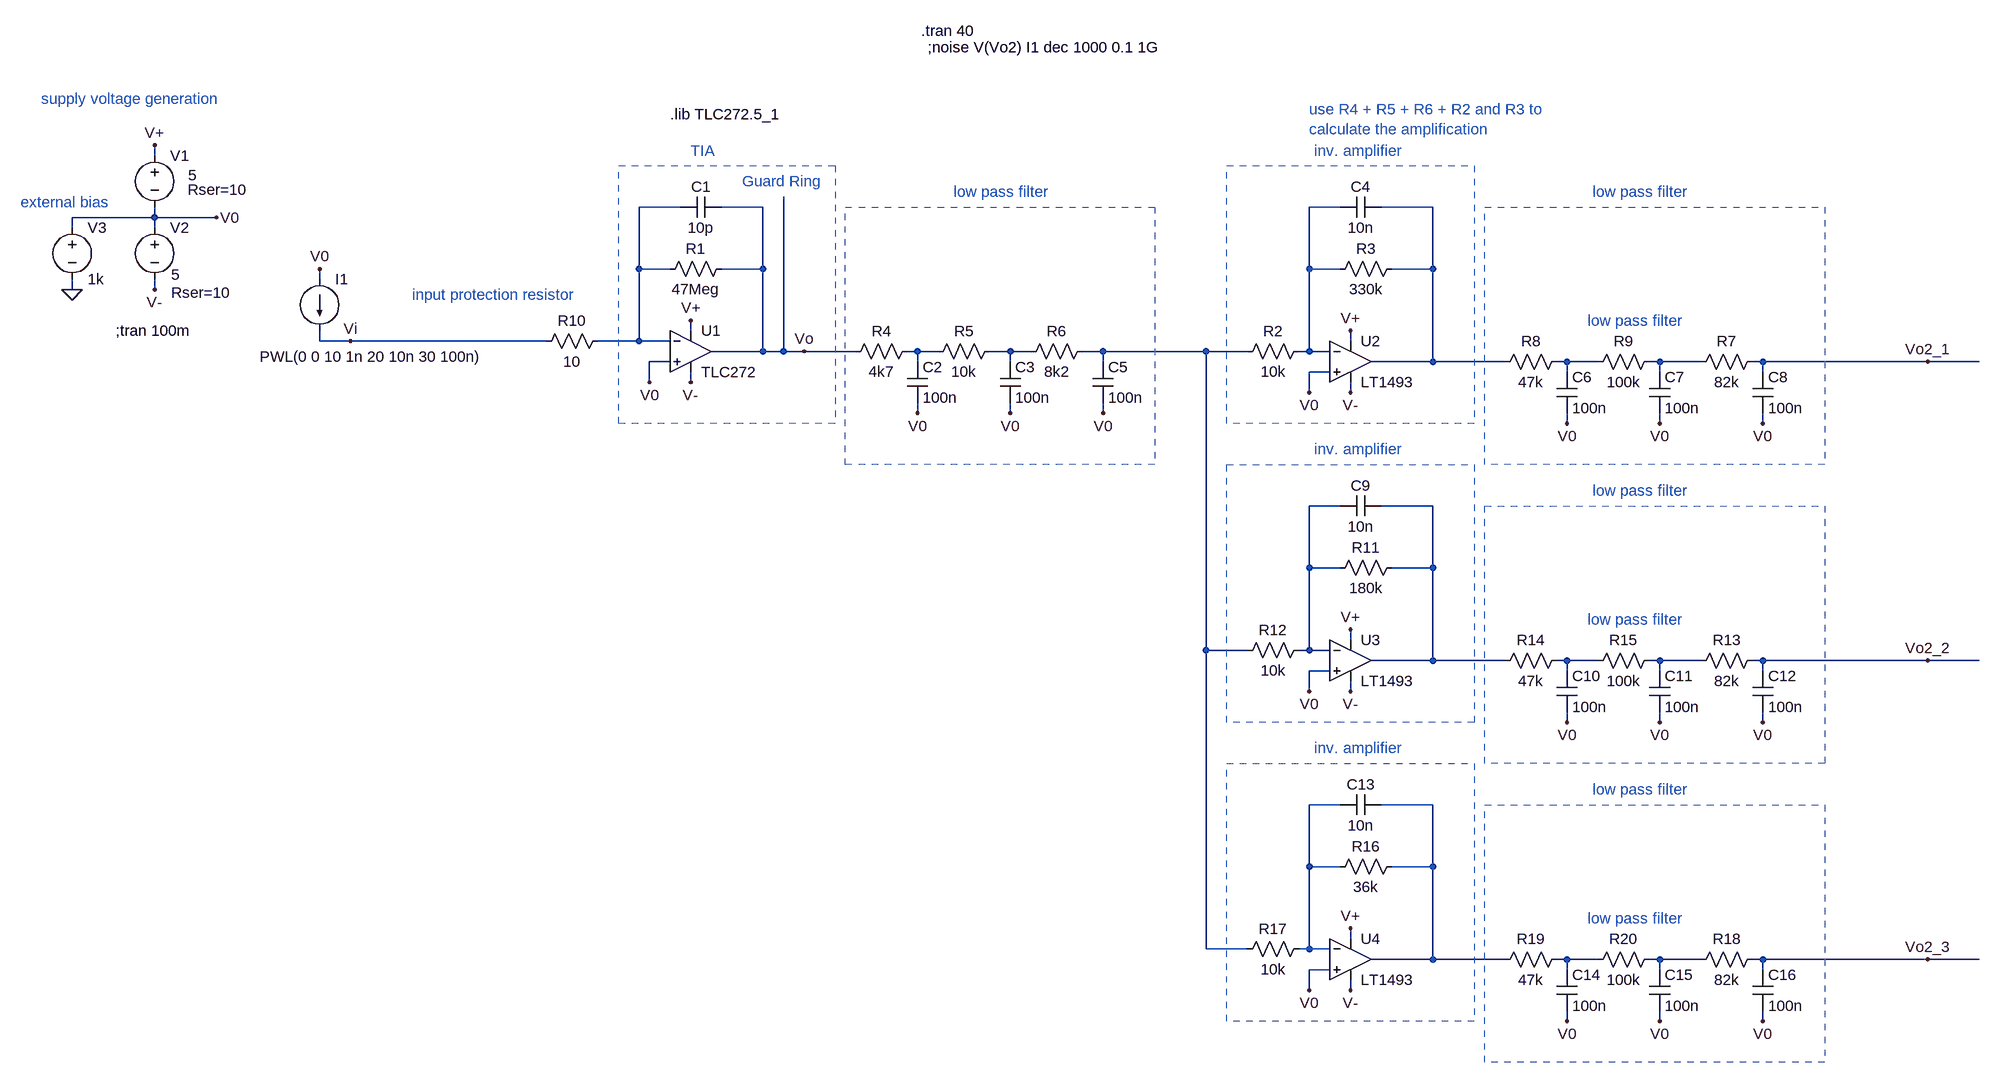
[diagram p0: schematic CurrentSensor.asc]
CurrentSensor.asc, the LTspice schematic file:
Version 4
SHEET 1 2468 1308
WIRE -736 -112 -736 -128
WIRE 80 -32 16 -32
WIRE 208 -32 144 -32
WIRE 1104 -32 1056 -32
WIRE 1248 -32 1168 -32
WIRE -736 -16 -736 -32
WIRE -736 -16 -864 -16
WIRE -640 -16 -736 -16
WIRE -864 0 -864 -16
WIRE -736 0 -736 -16
WIRE 16 64 16 -32
WIRE 64 64 16 64
WIRE 208 64 208 -32
WIRE 208 64 144 64
WIRE 1056 64 1056 -32
WIRE 1104 64 1056 64
WIRE 1248 64 1248 -32
WIRE 1248 64 1184 64
WIRE -480 80 -480 64
WIRE -864 96 -864 80
WIRE -736 96 -736 80
WIRE 96 160 96 144
WIRE -480 176 -480 160
WIRE -432 176 -480 176
WIRE -128 176 -432 176
WIRE 16 176 16 64
WIRE 16 176 -48 176
WIRE 64 176 16 176
WIRE 1120 176 1120 160
WIRE 208 192 208 64
WIRE 208 192 128 192
WIRE 240 192 240 -48
WIRE 240 192 208 192
WIRE 272 192 240 192
WIRE 352 192 272 192
WIRE 448 192 432 192
WIRE 480 192 448 192
WIRE 592 192 560 192
WIRE 624 192 592 192
WIRE 736 192 704 192
WIRE 896 192 736 192
WIRE 960 192 896 192
WIRE 1056 192 1056 64
WIRE 1056 192 1040 192
WIRE 1088 192 1056 192
WIRE 64 208 32 208
WIRE 448 208 448 192
WIRE 592 208 592 192
WIRE 736 208 736 192
WIRE 1248 208 1248 64
WIRE 1248 208 1152 208
WIRE 1360 208 1248 208
WIRE 1456 208 1440 208
WIRE 1504 208 1456 208
WIRE 1600 208 1584 208
WIRE 1664 208 1600 208
WIRE 1760 208 1744 208
WIRE 2016 208 1760 208
WIRE 2096 208 2016 208
WIRE 1088 224 1056 224
WIRE 1456 224 1456 208
WIRE 1600 224 1600 208
WIRE 1760 224 1760 208
WIRE 32 240 32 208
WIRE 96 240 96 224
WIRE 1056 256 1056 224
WIRE 1120 256 1120 240
WIRE 448 288 448 272
WIRE 592 288 592 272
WIRE 736 288 736 272
WIRE 1456 304 1456 288
WIRE 1600 304 1600 288
WIRE 1760 304 1760 288
WIRE 1104 432 1056 432
WIRE 1248 432 1168 432
WIRE 1056 528 1056 432
WIRE 1104 528 1056 528
WIRE 1248 528 1248 432
WIRE 1248 528 1184 528
WIRE 1120 640 1120 624
WIRE 896 656 896 192
WIRE 960 656 896 656
WIRE 1056 656 1056 528
WIRE 1056 656 1040 656
WIRE 1088 656 1056 656
WIRE 1248 672 1248 528
WIRE 1248 672 1152 672
WIRE 1360 672 1248 672
WIRE 1456 672 1440 672
WIRE 1504 672 1456 672
WIRE 1600 672 1584 672
WIRE 1664 672 1600 672
WIRE 1760 672 1744 672
WIRE 2016 672 1760 672
WIRE 2096 672 2016 672
WIRE 1088 688 1056 688
WIRE 1456 688 1456 672
WIRE 1600 688 1600 672
WIRE 1760 688 1760 672
WIRE 1056 720 1056 688
WIRE 1120 720 1120 704
WIRE 1456 768 1456 752
WIRE 1600 768 1600 752
WIRE 1760 768 1760 752
WIRE 1104 896 1056 896
WIRE 1248 896 1168 896
WIRE 1056 992 1056 896
WIRE 1104 992 1056 992
WIRE 1248 992 1248 896
WIRE 1248 992 1184 992
WIRE 1120 1104 1120 1088
WIRE 896 1120 896 656
WIRE 960 1120 896 1120
WIRE 1056 1120 1056 992
WIRE 1056 1120 1040 1120
WIRE 1088 1120 1056 1120
WIRE 1248 1136 1248 992
WIRE 1248 1136 1152 1136
WIRE 1360 1136 1248 1136
WIRE 1456 1136 1440 1136
WIRE 1504 1136 1456 1136
WIRE 1600 1136 1584 1136
WIRE 1664 1136 1600 1136
WIRE 1760 1136 1744 1136
WIRE 2016 1136 1760 1136
WIRE 2096 1136 2016 1136
WIRE 1088 1152 1056 1152
WIRE 1456 1152 1456 1136
WIRE 1600 1152 1600 1136
WIRE 1760 1152 1760 1136
WIRE 1056 1184 1056 1152
WIRE 1120 1184 1120 1168
WIRE 1456 1232 1456 1216
WIRE 1600 1232 1600 1216
WIRE 1760 1232 1760 1216
FLAG -736 -128 V+
FLAG -736 96 V-
FLAG 96 144 V+
FLAG 96 240 V-
FLAG 272 192 Vo
FLAG -480 64 V0
FLAG 32 240 V0
FLAG -640 -16 V0
FLAG -864 96 0
FLAG -432 176 Vi
FLAG 1120 160 V+
FLAG 1120 256 V-
FLAG 1056 256 V0
FLAG 2016 208 Vo2_1
FLAG 448 288 V0
FLAG 592 288 V0
FLAG 736 288 V0
FLAG 1456 304 V0
FLAG 1600 304 V0
FLAG 1760 304 V0
FLAG 1120 624 V+
FLAG 1120 720 V-
FLAG 1056 720 V0
FLAG 2016 672 Vo2_2
FLAG 1456 768 V0
FLAG 1600 768 V0
FLAG 1760 768 V0
FLAG 1120 1088 V+
FLAG 1120 1184 V-
FLAG 1056 1184 V0
FLAG 2016 1136 Vo2_3
FLAG 1456 1232 V0
FLAG 1600 1232 V0
FLAG 1760 1232 V0
SYMBOL Opamps\\opamp2 96 128 R0
SYMATTR InstName U1
SYMATTR Value TLC272
SYMBOL voltage -736 -128 R0
WINDOW 3 52 46 Left 2
WINDOW 123 0 0 Left 0
WINDOW 39 51 69 Left 2
SYMATTR InstName V1
SYMATTR Value 5
SYMATTR SpiceLine Rser=10
SYMBOL voltage -736 -16 R0
WINDOW 3 26 89 Left 2
WINDOW 123 0 0 Left 0
WINDOW 39 26 117 Left 2
SYMATTR InstName V2
SYMATTR Value 5
SYMATTR SpiceLine Rser=10
SYMBOL res 160 48 R90
WINDOW 0 0 56 VBottom 2
WINDOW 3 32 56 VTop 2
SYMATTR InstName R1
SYMATTR Value 47Meg
SYMBOL current -480 80 R0
WINDOW 3 -93 120 Left 2
WINDOW 123 0 0 Left 0
WINDOW 39 0 0 Left 0
SYMATTR InstName I1
SYMATTR Value PWL(0 0 10 1n 20 10n 30 100n)
SYMBOL voltage -864 -16 R0
WINDOW 123 0 0 Left 0
WINDOW 39 0 0 Left 0
SYMATTR InstName V3
SYMATTR Value 1k
SYMBOL res 720 176 R90
WINDOW 0 0 56 VBottom 2
WINDOW 3 32 56 VTop 2
SYMATTR InstName R6
SYMATTR Value 8k2
SYMBOL res 1200 48 R90
WINDOW 0 0 56 VBottom 2
WINDOW 3 32 56 VTop 2
SYMATTR InstName R3
SYMATTR Value 330k
SYMBOL cap 144 -48 R90
WINDOW 0 0 32 VBottom 2
WINDOW 3 32 32 VTop 2
SYMATTR InstName C1
SYMATTR Value 10p
SYMBOL res 448 176 R90
WINDOW 0 0 56 VBottom 2
WINDOW 3 32 56 VTop 2
SYMATTR InstName R4
SYMATTR Value 4k7
SYMBOL cap 432 208 R0
SYMATTR InstName C2
SYMATTR Value 100n
SYMBOL res 576 176 R90
WINDOW 0 0 56 VBottom 2
WINDOW 3 32 56 VTop 2
SYMATTR InstName R5
SYMATTR Value 10k
SYMBOL cap 576 208 R0
SYMATTR InstName C3
SYMATTR Value 100n
SYMBOL cap 1168 -48 R90
WINDOW 0 0 32 VBottom 2
WINDOW 3 32 32 VTop 2
SYMATTR InstName C4
SYMATTR Value 10n
SYMBOL cap 720 208 R0
SYMATTR InstName C5
SYMATTR Value 100n
SYMBOL res 1056 176 R90
WINDOW 0 0 56 VBottom 2
WINDOW 3 32 56 VTop 2
SYMATTR InstName R2
SYMATTR Value 10k
SYMBOL res 1760 192 R90
WINDOW 0 0 56 VBottom 2
WINDOW 3 32 56 VTop 2
SYMATTR InstName R7
SYMATTR Value 82k
SYMBOL res 1456 192 R90
WINDOW 0 0 56 VBottom 2
WINDOW 3 32 56 VTop 2
SYMATTR InstName R8
SYMATTR Value 47k
SYMBOL cap 1440 224 R0
SYMATTR InstName C6
SYMATTR Value 100n
SYMBOL res 1600 192 R90
WINDOW 0 0 56 VBottom 2
WINDOW 3 32 56 VTop 2
SYMATTR InstName R9
SYMATTR Value 100k
SYMBOL cap 1584 224 R0
SYMATTR InstName C7
SYMATTR Value 100n
SYMBOL cap 1744 224 R0
SYMATTR InstName C8
SYMATTR Value 100n
SYMBOL res -32 160 R90
WINDOW 0 0 56 VBottom 2
WINDOW 3 32 56 VTop 2
SYMATTR InstName R10
SYMATTR Value 10
SYMBOL res 1200 512 R90
WINDOW 0 0 56 VBottom 2
WINDOW 3 32 56 VTop 2
SYMATTR InstName R11
SYMATTR Value 180k
SYMBOL cap 1168 416 R90
WINDOW 0 0 32 VBottom 2
WINDOW 3 32 32 VTop 2
SYMATTR InstName C9
SYMATTR Value 10n
SYMBOL res 1056 640 R90
WINDOW 0 0 56 VBottom 2
WINDOW 3 32 56 VTop 2
SYMATTR InstName R12
SYMATTR Value 10k
SYMBOL res 1760 656 R90
WINDOW 0 0 56 VBottom 2
WINDOW 3 32 56 VTop 2
SYMATTR InstName R13
SYMATTR Value 82k
SYMBOL res 1456 656 R90
WINDOW 0 0 56 VBottom 2
WINDOW 3 32 56 VTop 2
SYMATTR InstName R14
SYMATTR Value 47k
SYMBOL cap 1440 688 R0
SYMATTR InstName C10
SYMATTR Value 100n
SYMBOL res 1600 656 R90
WINDOW 0 0 56 VBottom 2
WINDOW 3 32 56 VTop 2
SYMATTR InstName R15
SYMATTR Value 100k
SYMBOL cap 1584 688 R0
SYMATTR InstName C11
SYMATTR Value 100n
SYMBOL cap 1744 688 R0
SYMATTR InstName C12
SYMATTR Value 100n
SYMBOL res 1200 976 R90
WINDOW 0 0 56 VBottom 2
WINDOW 3 32 56 VTop 2
SYMATTR InstName R16
SYMATTR Value 36k
SYMBOL cap 1168 880 R90
WINDOW 0 0 32 VBottom 2
WINDOW 3 32 32 VTop 2
SYMATTR InstName C13
SYMATTR Value 10n
SYMBOL res 1056 1104 R90
WINDOW 0 0 56 VBottom 2
WINDOW 3 32 56 VTop 2
SYMATTR InstName R17
SYMATTR Value 10k
SYMBOL res 1760 1120 R90
WINDOW 0 0 56 VBottom 2
WINDOW 3 32 56 VTop 2
SYMATTR InstName R18
SYMATTR Value 82k
SYMBOL res 1456 1120 R90
WINDOW 0 0 56 VBottom 2
WINDOW 3 32 56 VTop 2
SYMATTR InstName R19
SYMATTR Value 47k
SYMBOL cap 1440 1152 R0
SYMATTR InstName C14
SYMATTR Value 100n
SYMBOL res 1600 1120 R90
WINDOW 0 0 56 VBottom 2
WINDOW 3 32 56 VTop 2
SYMATTR InstName R20
SYMATTR Value 100k
SYMBOL cap 1584 1152 R0
SYMATTR InstName C15
SYMATTR Value 100n
SYMBOL cap 1744 1152 R0
SYMATTR InstName C16
SYMATTR Value 100n
SYMBOL Opamps\\LT1493 1120 144 R0
SYMATTR InstName U2
SYMBOL Opamps\\LT1493 1120 608 R0
SYMATTR InstName U3
SYMBOL Opamps\\LT1493 1120 1072 R0
SYMATTR InstName U4
TEXT 64 -176 Left 2 !.lib TLC272.5_1
TEXT -796 160 Left 2 !;tran 100m
TEXT 176 -72 Left 2 ;Guard Ring
TEXT -944 -40 Left 2 ;external bias
TEXT -912 -200 Left 2 ;supply voltage generation
TEXT 96 -120 Left 2 ;TIA
TEXT 1064 -120 Left 2 ;inv. amplifier
TEXT 464 -280 Left 2 !;noise V(Vo2) I1 dec 1000 0.1 1G
TEXT 504 -56 Left 2 ;low pass filter
TEXT 1488 144 Left 2 ;low pass filter
TEXT 454 -306 Left 2 !.tran 40
TEXT 1496 -56 Left 2 ;low pass filter
TEXT 1056 -184 Left 2 ;use R4 + R5 + R6 + R2 and R3 to \ncalculate the amplification
TEXT -336 104 Left 2 ;input protection resistor
TEXT 1064 344 Left 2 ;inv. amplifier
TEXT 1488 608 Left 2 ;low pass filter
TEXT 1496 408 Left 2 ;low pass filter
TEXT 1064 808 Left 2 ;inv. amplifier
TEXT 1488 1072 Left 2 ;low pass filter
TEXT 1496 872 Left 2 ;low pass filter
RECTANGLE Normal 320 304 -16 -96 2
RECTANGLE Normal 1312 304 928 -96 2
RECTANGLE Normal 1856 368 1328 -32 2
RECTANGLE Normal 816 368 336 -32 2
RECTANGLE Normal 1312 768 928 368 2
RECTANGLE Normal 1856 832 1328 432 2
RECTANGLE Normal 1312 1232 928 832 2
RECTANGLE Normal 1856 1296 1328 896 2

The netlist it stands for:
* CurrentSensor.asc
XU1 V0 N001 V+ V- Vo TLC272  ; pins In+ In- V+ V- OUT
V1 V+ V0 5 Rser=10
V2 V0 V- 5 Rser=10
R1 Vo N001 47Meg
I1 V0 Vi PWL(0 0 10 1n 20 10n 30 100n)
V3 V0 0 1k
R6 N006 N005 8k2
R3 N003 N002 330k
C1 Vo N001 10p
R4 N004 Vo 4k7
C2 N004 V0 100n
R5 N005 N004 10k
C3 N005 V0 100n
C4 N003 N002 10n
C5 N006 V0 100n
R2 N002 N006 10k
R7 Vo2_1 N008 82k
R8 N007 N003 47k
C6 N007 V0 100n
R9 N008 N007 100k
C7 N008 V0 100n
C8 Vo2_1 V0 100n
R10 N001 Vi 10
R11 N010 N009 180k
C9 N010 N009 10n
R12 N009 N006 10k
R13 Vo2_2 N012 82k
R14 N011 N010 47k
C10 N011 V0 100n
R15 N012 N011 100k
C11 N012 V0 100n
C12 Vo2_2 V0 100n
R16 N014 N013 36k
C13 N014 N013 10n
R17 N013 N006 10k
R18 Vo2_3 N016 82k
R19 N015 N014 47k
C14 N015 V0 100n
R20 N016 N015 100k
C15 N016 V0 100n
C16 Vo2_3 V0 100n
XU2 V0 N002 V+ V- N003 LT1493  ; pins In+ In- V+ V- OUT
XU3 V0 N009 V+ V- N010 LT1493  ; pins In+ In- V+ V- OUT
XU4 V0 N013 V+ V- N014 LT1493  ; pins In+ In- V+ V- OUT
.lib TLC272.5_1
;tran 100m
* Guard Ring
* external bias
* supply voltage generation
* TIA
* inv. amplifier
;noise V(Vo2) I1 dec 1000 0.1 1G
* low pass filter
* low pass filter
.tran 40
* low pass filter
* use R4 + R5 + R6 + R2 and R3 to
* calculate the amplification
* input protection resistor
* inv. amplifier
* low pass filter
* low pass filter
* inv. amplifier
* low pass filter
* low pass filter
.backanno
.end